# Altium schematic sheet PLWD_LTE_stmod.SchDoc: STMOD+
size A3; Date: Not used; ApprovedBy: Not used; CheckedBy: Not used; Author: Not used; CompanyName: STMicroelectronics; DrawnBy: Not used; Engineer: Not used; Organization: Not used; Address1: Not used; Address2: Not used; Address3: Not used; Address4: Not used; DocumentNumber: 2; Revision: Not used; SheetNumber: 12; SheetTotal: 12; CurrentTime: Not used; CurrentDate: Not used; Time: Not used; DocumentFullPathAndName: Not used; DocumentName: Not used; ModifiedDate: Not used; ImagePath: Not used; ProjectName: Not used; Application_BuildNumber: Not used
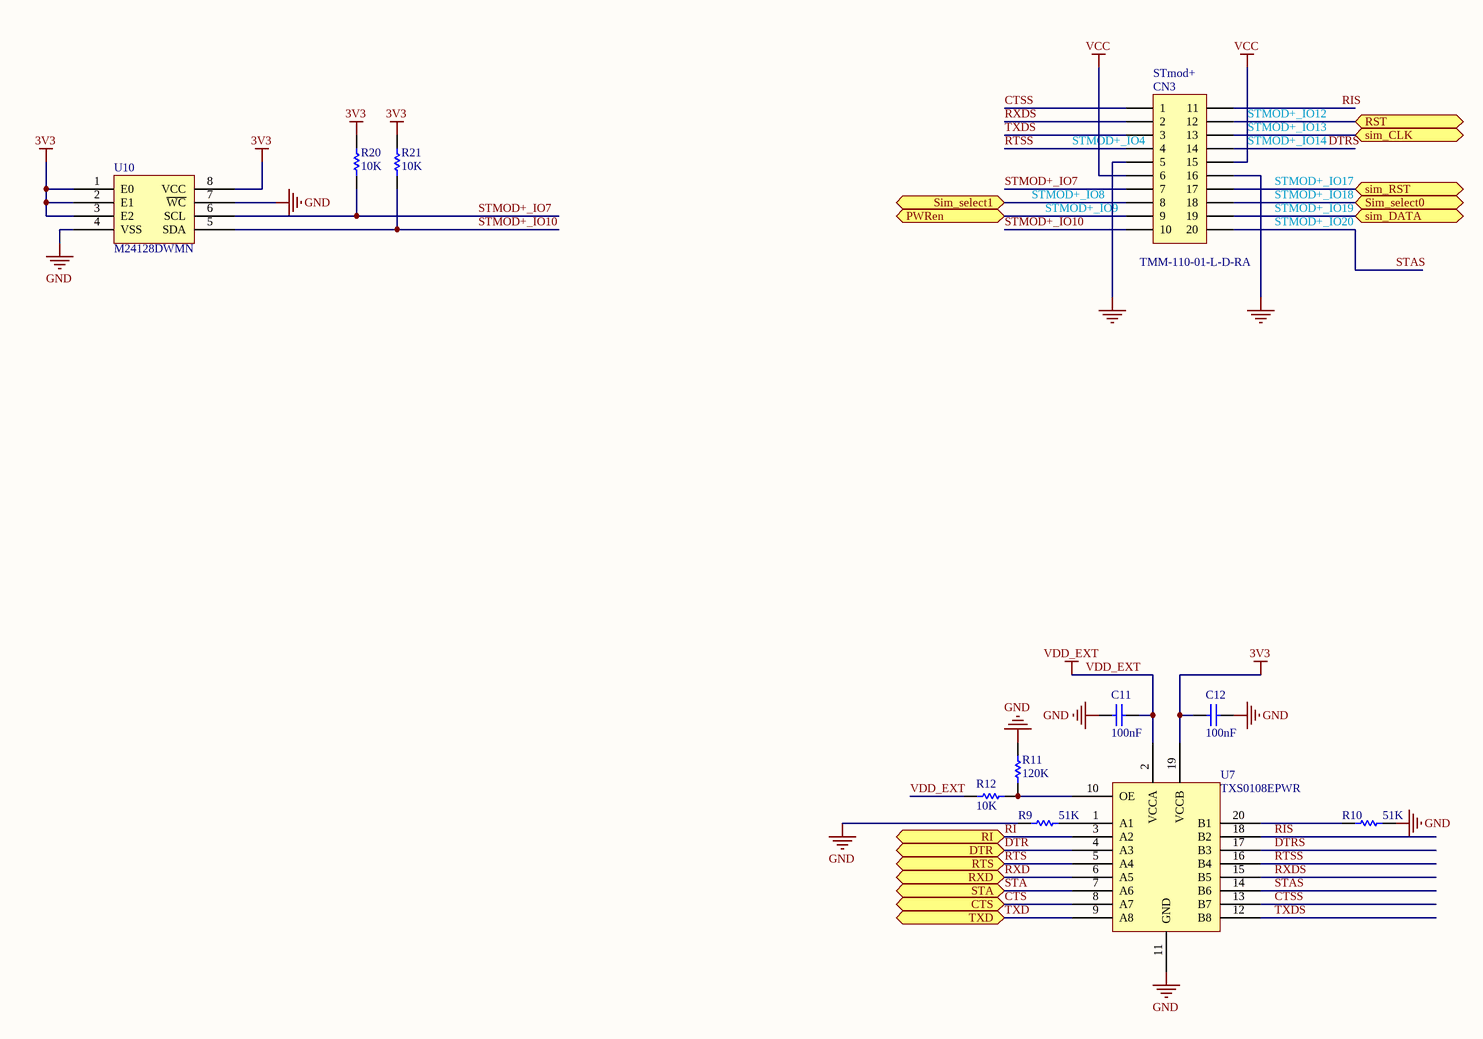
[diagram p0: PLWD_LTE_stmod.SchDoc]

## Parts
C11  value 100nF  [C0402]  (hidden comment: Capacitor)
C12  value 100nF  [C0402]  (hidden comment: Capacitor)
CN3  TMM-110-01-L-D-RA  [CON_SAMTEC_TMM-110-01-L-D-RA__STMOD+]
R9  value 51K  [R0402]  (hidden comment: Resistor)
R10  value 51K  [R0402]  (hidden comment: Resistor)
R11  value 120K  [R0402]  (hidden comment: Resistor)
R12  value 10K  [R0603]  (hidden comment: Resistor)
R20  value 10K  [R0402]  (hidden comment: Resistor)
R21  value 10K  [R0402]  (hidden comment: Resistor)
U7  TXS0108EPWR  [ICC_TSSOP20_6P50X4P40_P065]
U10  M24128DWMN  [ICC_SO8_5X4_P127]

## Ports
CTS (bidir), DTR (bidir), PWRen (bidir), RI (bidir), RST (bidir), RTS (bidir), RXD (bidir), sim_CLK (bidir), sim_DATA (bidir), sim_RST (bidir), Sim_select0 (bidir), Sim_select1 (bidir), STA (bidir), TXD (bidir)

## Nets
3V3: C12.1 R20.2 R21.2 U7.19(VCCB) U10.1(E0) U10.2(E1) U10.3(E2) U10.8(VCC)
GND: C11.1 C12.2 CN3.5 CN3.16 R9.1 R10.2 R11.2 U7.11(GND) U10.4(VSS) U10.7(~{WC})
VCC: CN3.6 CN3.15
VDD_EXT: C11.2 R12.1 U7.2(VCCA)
CTS: U7.8(A7) ; port CTS
CTSS: CN3.1 U7.13(B7)
DTR: U7.4(A3) ; port DTR
DTRS: CN3.14 U7.17(B3)
PWRen: CN3.9 ; port PWRen
RI: U7.3(A2) ; port RI
RIS: CN3.11 U7.18(B2)
RST: CN3.12 ; port RST
RTS: U7.5(A4) ; port RTS
RTSS: CN3.4 U7.16(B4)
RXD: U7.6(A5) ; port RXD
RXDS: CN3.2 U7.15(B5)
sim_CLK: CN3.13 ; port sim_CLK
sim_DATA: CN3.19 ; port sim_DATA
sim_RST: CN3.17 ; port sim_RST
Sim_select0: CN3.18 ; port Sim_select0
Sim_select1: CN3.8 ; port Sim_select1
STA: U7.7(A6) ; port STA
STAS: CN3.20 U7.14(B6)
STMOD+_IO7: CN3.7 R20.1 U10.6(SCL)
STMOD+_IO10: CN3.10 R21.1 U10.5(SDA)
TXD: U7.9(A8) ; port TXD
TXDS: CN3.3 U7.12(B8)
NetR9_2: R9.2 U7.1(A1)
NetR10_1: R10.1 U7.20(B1)
NetR11_1: R11.1 R12.2 U7.10(OE)

## Notes on the sheet
- (near CN3) STmod+
- (near CN3) STMOD+_IO4
- (near CN3) STMOD+_IO12
- (near CN3) STMOD+_IO13
- (near CN3) STMOD+_IO14
- STMOD+_IO8
- (near CN3) STMOD+_IO9
- STMOD+_IO17
- STMOD+_IO18
- STMOD+_IO19
- STMOD+_IO20
- Title:
- Project:
- Size:
- Revision:
- Variant:
- A4
- -
- Date:
- Reference:
- Sheet:
- of

## Library data of the parts
C11 C12 = MCD-00006: Capacitor,100nF,16V,X7R,10%,0402,YAGEO; Manufacturer_Part_Number: CC0402KRX7R7BB104; Provided_By: Subcon; Internal_Part_Number: MCD-00006; PartType: Capacitors; ComponentLink1URL: Yageo_Capacitor_X7R-series.pdf; ECCN_US: n/a; ECCN_EU: n/a; Manufacturer: YAGEO; ComponentLink1Description: Yageo_Capacitor_X7R-series.pdf
CN3 = MCD-00288: Header 20 pins 2 row; Manufacturer: SAMTEC; Provided_By: SubCon; Internal_Part_Number: MCD-00288; Value: TMM-110-01-L-D-RA; PartType: CONN; Manufacturer_Part_Number: TMM-110-01-L-D-RA; ComponentLink1Description: TMM-110-01-L-D-RA
R9 R10 = MCD-00294: Resistor,51K,0402,1%,YAGEO; Manufacturer_Part_Number: RC0402FR-0751KL; Provided_By: Subcon; Internal_Part_Number: MCD-00294; PartType: Resistors; Manufacturer: YAGEO; ComponentLink1Description: Yageo_Resistor_RC0402-series.pdf; ComponentLink1URL: Yageo_Resistor_RC0402-series.pdf; ECCN_US: n/a; ECCN_EU: n/a
R11 = MCD-00166: Resistor,120K,0402,1%,YAGEO; Manufacturer_Part_Number: RC0402FR-07120KL; Provided_By: Subcon; Internal_Part_Number: MCD-00166; PartType: Resistors; ComponentLink1URL: Yageo_Resistor_RC0402-series.pdf; ECCN_US: n/a; ECCN_EU: n/a; Manufacturer: YAGEO; ComponentLink1Description: Yageo_Resistor_RC0402-series.pdf
R12 = MCD-00220: Resistor,10K,0603,1%,YAGEO; Manufacturer_Part_Number: RC0603FR-0710KL; Provided_By: Subcon; Internal_Part_Number: MCD-00220; PartType: Resistors; ComponentLink1URL: Yageo_Resistor_RC0603-series.pdf; ECCN_US: n/a; ECCN_EU: n/a; Manufacturer: YAGEO; ComponentLink1Description: Yageo_Resistor_RC0603-series.pdf
R20 R21 = MCD-00053: Resistor,10K,0402,1%; Manufacturer_Part_Number: RC0402FR-0710KL; Manufacturer: YAGEO; Provided_By: subcon; Internal_Part_Number: MCD-00053; PartType: Resistors; ComponentLink1Description: Yageo_Resistor_RC0402-series.pdf; ECCN_US: n/a; ECCN_EU: n/a
U7 = MCD-00289: bidirectionnal level shifter; Manufacturer: TEXAS INSTRUMENTS; Provided_By: Subcon; Internal_Part_Number: MCD-00289; Value: TXS0108EPWR; PartType: ICS; Manufacturer_Part_Number: TXS0108EPWR; ComponentLink1Description: TXS0108EPWR.pdf
U10 = MCD-00293: I2C memory; Manufacturer: ST; Internal_Part_Number: MCD-00293; Value: M24128DWMN; PartType: ICS; Manufacturer_Part_Number: M24128DWMN; ComponentLink1Description: M24128DWMN.pdf; Provided_By: ST